# Altium schematic sheet ESP32-C3.SchDoc
size C; Date: 6/12/2025; CheckedBy: -; DrawnBy: Engr. Khaqan; Revision: -; SheetNumber: 1; SheetTotal: 1; Size: A3; VerifiedBy: -
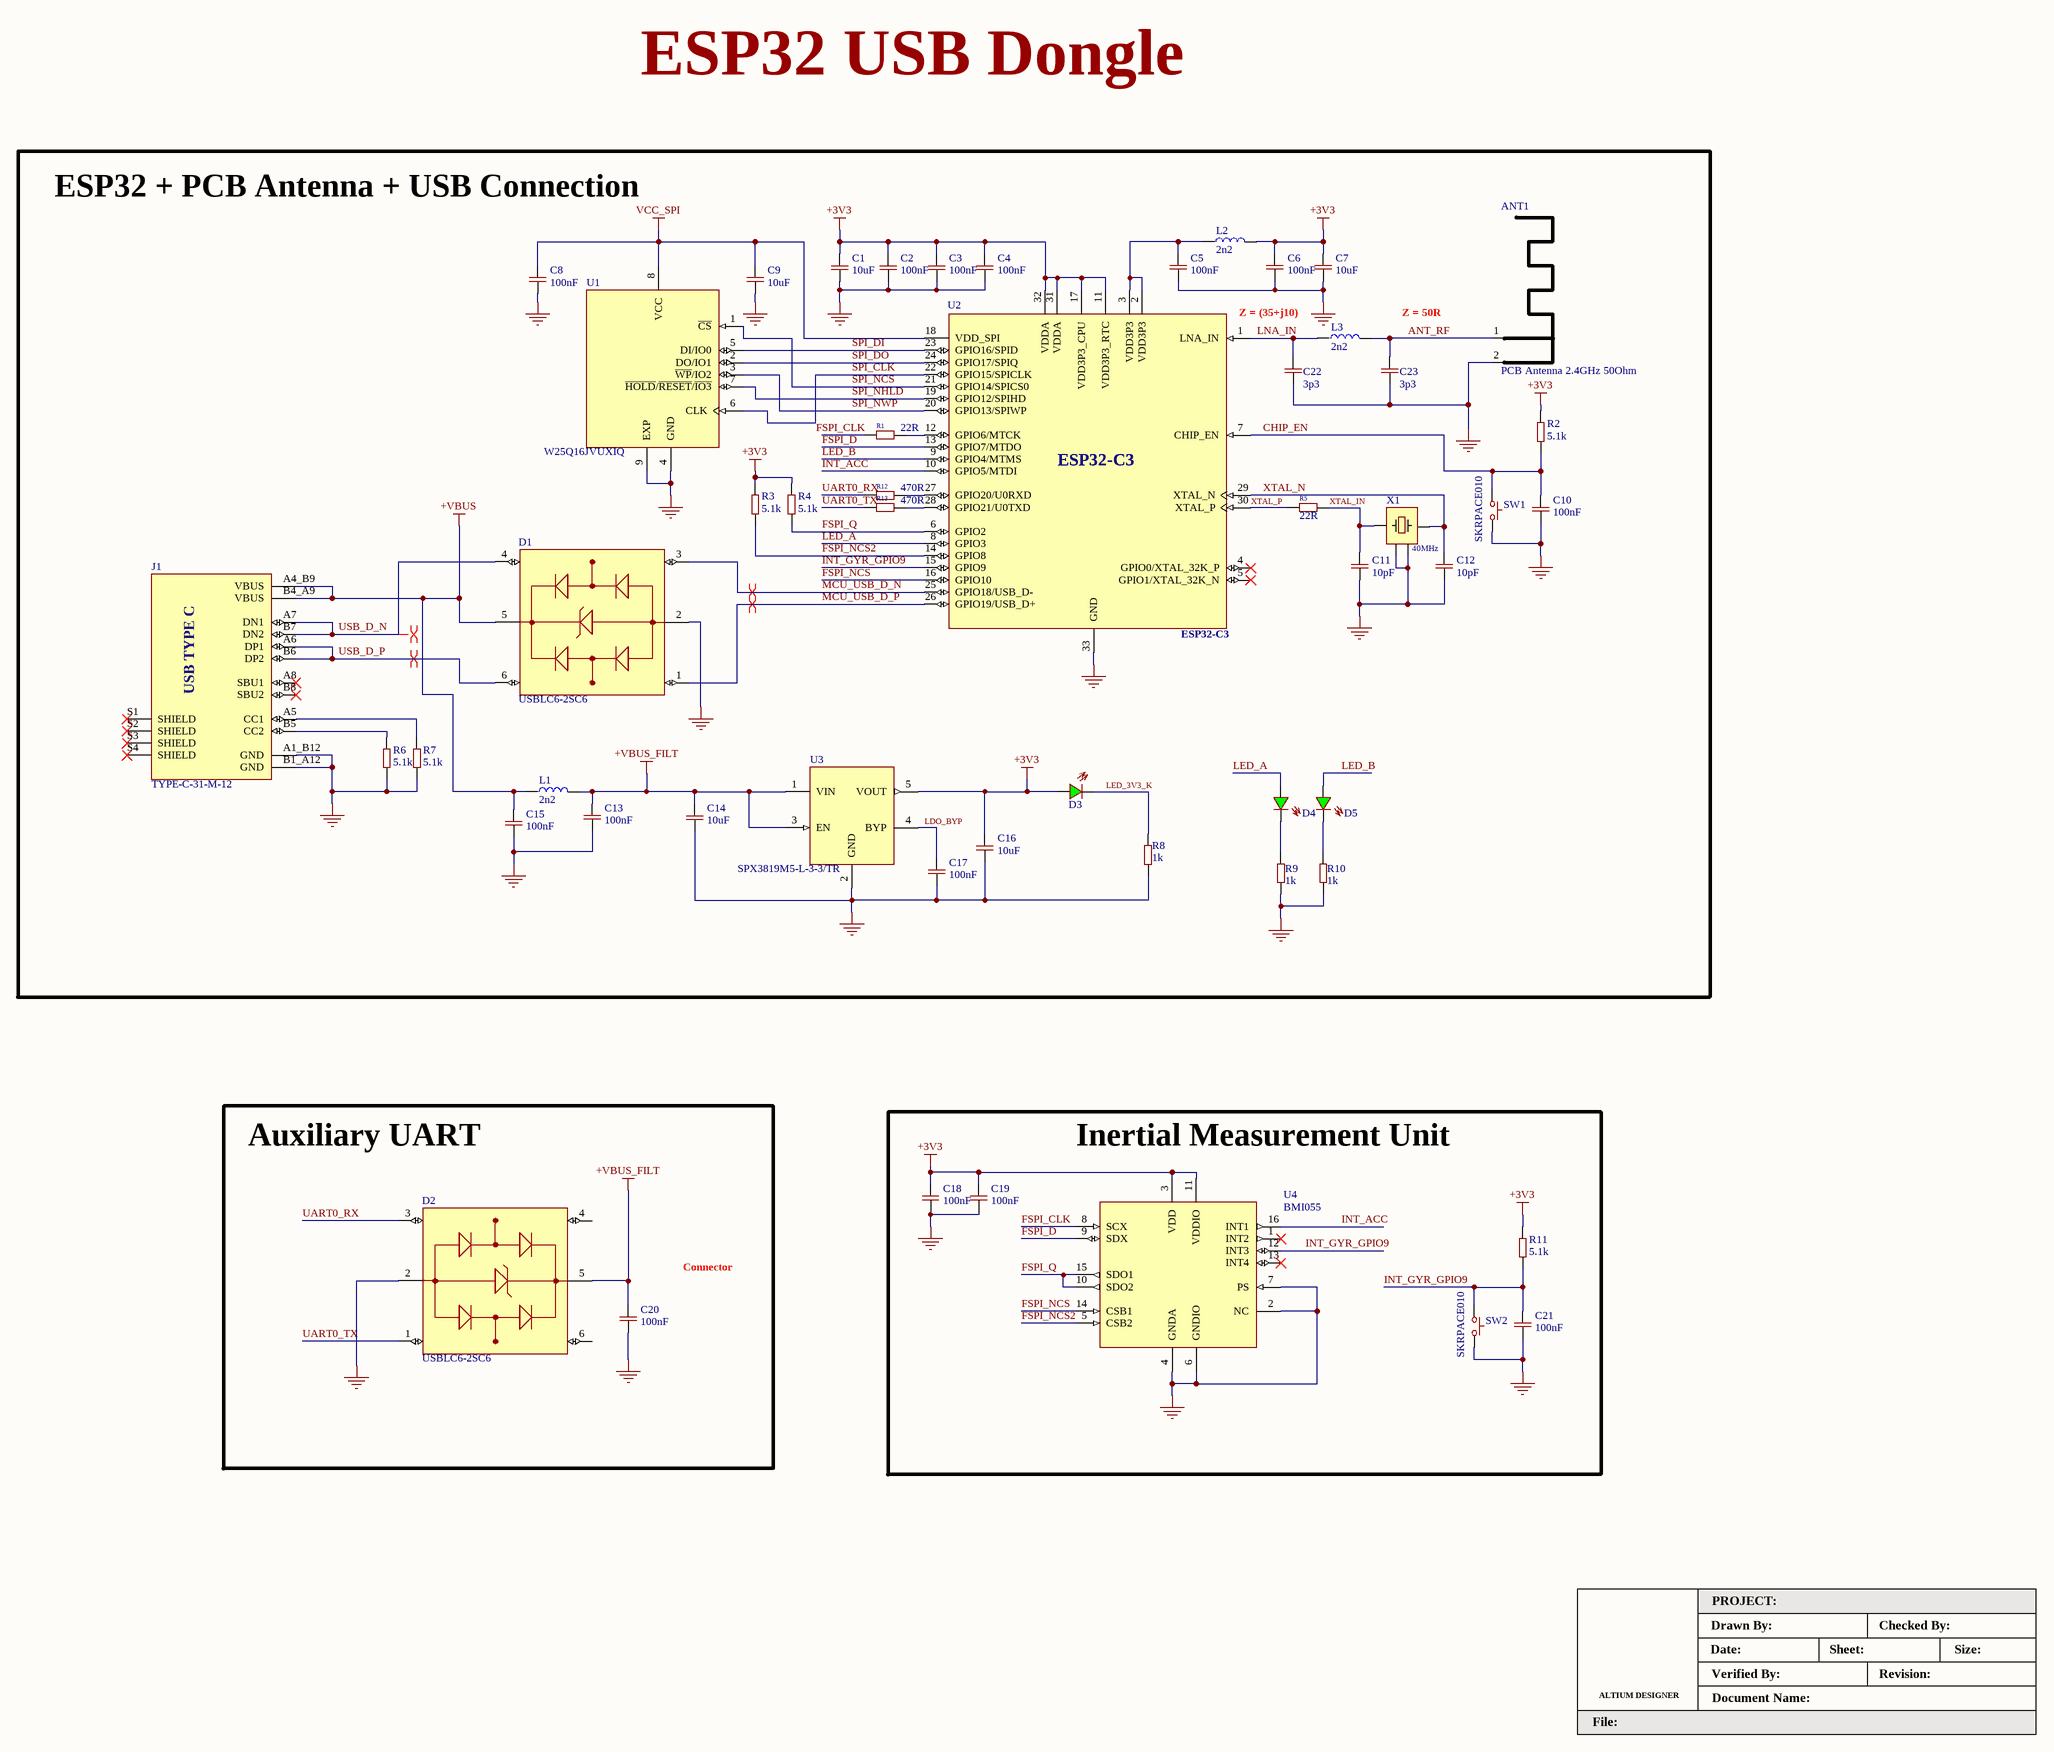
[diagram p0: ESP32-C3.SchDoc]

## Parts
ANT1  PCB Antenna 2.4GHz 50Ohm  [ANT_IFA_USB_2_4GHz_50R]
C1  10uF  [CAP_0603]
C2  100nF  [CAP_0402]
C3  100nF  [CAP_0402]
C4  100nF  [CAP_0402]
C5  100nF  [CAP_0402]
C6  100nF  [CAP_0402]
C7  10uF  [CAP_0603]
C8  100nF  [CAP_0402]
C9  10uF  [CAP_0603]
C10  100nF  [CAP_0402]
C11  10pF  [CAP_0402]
C12  10pF  [CAP_0402]
C13  100nF  [CAP_0402]
C14  10uF  [CAP_0603]
C15  100nF  [CAP_0402]
C16  10uF  [CAP_0603]
C17  100nF  [CAP_0402]
C18  100nF  [CAP_0402]
C19  100nF  [CAP_0402]
C20  100nF  [CAP_0402]
C21  100nF  [CAP_0402]
C22  3p3  [CAP_0402]
C23  3p3  [CAP_0402]
D1  USBLC6-2SC6  [USBLC6-2SC6]
D2  USBLC6-2SC6  [USBLC6-2SC6]
D3  16-213/GHC-YR1S1/3T  [LED_0402_GREEN_SMD]  (value not drawn)
D4  16-213/GHC-YR1S1/3T  [LED_0402_GREEN_SMD]  (value not drawn)
D5  16-213/GHC-YR1S1/3T  [LED_0402_GREEN_SMD]  (value not drawn)
J1  TYPE-C-31-M-12  [TYPE-C-31-M-12]
L1  2n2  [IND_SMD_0402]
L2  2n2  [IND_SMD_0402]
L3  2n2  [IND_SMD_0402]
R1  22R  [RES_0402]
R2  5.1k  [RES_0402]
R3  5.1k  [RES_0402]
R4  5.1k  [RES_0402]
R5  22R  [RES_0402]
R6  5.1k  [RES_0402]
R7  5.1k  [RES_0402]
R8  1k  [RES_0402]
R9  1k  [RES_0402]
R10  1k  [RES_0402]
R11  5.1k  [RES_0402]
R12  470R  [RES_0402]
R13  470R  [RES_0402]
SW1  SKRPACE010  [Tactile Switch]
SW2  SKRPACE010  [Tactile Switch]
U1  W25Q16JVUXIQ  [W25Q16JVUXIQ]
U2  ESP32-C3  [ESP32-C3]
U3  SPX3819M5-L-3-3/TR  [SPX3819M5-L-3-3/TR]
U4  BMI055  [BMI055]
X1  40MHz  [XTAL_40MHz_2520]

## Blocks framed on the sheet
ESP32 + PCB Antenna + USB Connection: ANT1 C1-C17 C22 C23 D1 D3-D5 J1 L1-L3 R1-R10 R12 R13 SW1 U1-U3 X1
Auxiliary UART: C20 D2
Inertial Measurement Unit: C18 C19 C21 R11 SW2 U4

## Nets
+3V3: C1.2 C2.2 C3.2 C4.2 C6.2 C7.2 C16.2 C18.2 C19.2 D3.1 L2.2 R2.2 R3.2 R4.2 R11.2 U2.11(VDD3P3_RTC) U2.17(VDD3P3_CPU) U2.31(VDDA) U2.32(VDDA) U3.5(VOUT) U4.3(VDD) U4.11(VDDIO)
+VBUS: C15.2 D1.5(VBUS) J1.A4_B9(VBUS) J1.B4_A9(VBUS) L1.1
+VBUS_FILT: C13.2 C14.2 C20.2 D2.5(VBUS) L1.2 U3.1(VIN) U3.3(EN)
GND: ANT1.2(GND) C1.1 C2.1 C3.1 C4.1 C5.1 C6.1 C7.1 C8.1 C9.1 C10.1 C11.1 C12.1 C13.1 C14.1 C15.1 C16.1 C17.1 C18.1 C19.1 C20.1 C21.1 C22.1 C23.1 D1.2(GND) D2.2(GND) J1.A1_B12(GND) J1.B1_A12(GND) R6.1 R7.1 R8.1 R9.1 R10.1 SW1.2 SW2.2 U1.4(GND) U1.9(EXP) U2.33(GND) U3.2(GND) U4.2(NC) U4.4(GNDA) U4.6(GNDIO) U4.7(PS) X1.2 X1.4
VCC_SPI: C8.2 C9.2 U1.8(VCC) U2.18(VDD_SPI)
ANT_RF: ANT1.1(RF) C23.2 L3.2
CHIP_EN: C10.2 R2.1 SW1.1 U2.7(CHIP_EN)
FSPI_CLK: U4.8(SCX)
FSPI_D: U2.13(GPIO7/MTDO) U4.9(SDX)
FSPI_NCS: U2.16(GPIO10) U4.14(CSB1)
FSPI_NCS2: R3.1 U2.14(GPIO8) U4.5(CSB2)
FSPI_Q: R4.1 U2.6(GPIO2) U4.10(SDO2) U4.15(SDO1)
INT_ACC: U2.10(GPIO5/MTDI) U4.16(INT1)
INT_GYR_GPIO9: C21.2 R11.1 SW2.1 U2.15(GPIO9) U4.12(INT3)
LDO_BYP: C17.2 U3.4(BYP)
LED_3V3_K: D3.2 R8.2
LED_A: D4.1 U2.8(GPIO3)
LED_B: D5.1 U2.9(GPIO4/MTMS)
LNA_IN: C22.2 L3.1 U2.1(LNA_IN)
MCU_USB_D_N: D1.3(I/O2_IN) U2.25(GPIO18/USB_D-)
MCU_USB_D_P: D1.1(I/O1_IN) U2.26(GPIO19/USB_D+)
SPI_CLK: U1.6(CLK) U2.22(GPIO15/SPICLK)
SPI_DI: U1.5(DI/IO0) U2.23(GPIO16/SPID)
SPI_DO: U1.2(DO/IO1) U2.24(GPIO17/SPIQ)
SPI_NCS: U1.1(~{CS}) U2.21(GPIO14/SPICS0)
SPI_NHLD: U1.7(~{HOLD}/~{RESET}/~{IO3}) U2.19(GPIO12/SPIHD)
SPI_NWP: U1.3(~{WP}/IO2) U2.20(GPIO13/SPIWP)
UART0_RX: D2.3(I/O2_IN) R12.1
UART0_TX: D2.1(I/O1_IN) R13.1
USB_D_N: D1.4(I/O2_OUT) J1.A7(DN1) J1.B7(DN2)
USB_D_P: D1.6(I/O1_OUT) J1.A6(DP1) J1.B6(DP2)
XTAL_IN: C11.2 R5.2 X1.1
XTAL_N: C12.2 U2.29(XTAL_N) X1.3
XTAL_P: R5.1 U2.30(XTAL_P)
NetC5_2: C5.2 L2.1 U2.2(VDD3P3) U2.3(VDD3P3)
NetD4_2: D4.2 R9.2
NetD5_2: D5.2 R10.2
NetJ1_A5: J1.A5(CC1) R7.2
NetJ1_B5: J1.B5(CC2) R6.2
NetR1_2: R1.2 U2.12(GPIO6/MTCK)
NetR12_2: R12.2 U2.27(GPIO20/U0RXD)
NetR13_2: R13.2 U2.28(GPIO21/U0TXD)

Not connected (* = marked no-connect by the designer): D2 4(I/O2_OUT) 6(I/O1_OUT); J1 A8(SBU1)* B8(SBU2)* S1(SHIELD)* S2(SHIELD)* S3(SHIELD)* S4(SHIELD)*; R1 1; U2 4(GPIO0/XTAL_32K_P)* 5(GPIO1/XTAL_32K_N)*; U4 1(INT2)* 13(INT4)*

## Layout directives
differential pair: MCU_USB_D_N, MCU_USB_D_P, USB_D_N, USB_D_P

## Notes on the sheet
- ESP32 USB Dongle
- (near U2) Z = (35+j10)
- Z = 50R
- Connector
- PROJECT:
- Date:
- Drawn By:
- Verified By:
- Sheet:
- Revision:
- Checked By:
- Size:
- ALTIUM DESIGNER
- File:
- Document Name:
- Labels drawn without touching a wire or pin: FSPI_CLK
- (in symbol TYPE-C-31-M-12) USB TYPE C

## Library data of the parts
ANT1 = ANT_IFA_USB_2_4GHz_50R: Inverted F 2.4GHz ISM PCB Antenna 50Ohm
C1 C7 C9 C14 C16 = CAP_0603: Ceramic Capacitor, Multilayer, Ceramic, 10V, 10% +Tol, 10% -Tol, X5R, +-15% TC, 10uF, Surface Mount, 0603 inch; Manufacturer: Samsung Electro-Mechanics; Manufacturer Part Number: CL10A106KP8NNNC; Value: 10µF; LCSC: C19702; Supplier: DigiKey; Supplier Part Number: 1276-1192-1-ND; RoHS: Compliant; Category: Ceramic Capacitors; Stock: 3199651; Pricing: 1=0.08, 10=0.027 (USD); Case/Package: 0603; Case Code (Imperial): 0603; Case Code (Metric): 1608; China RoHS: Compliant; Contact Plating: Tin; Depth: 800µm; Dielectric: X5R; Dielectric Material: Ceramic; Height: 800µm; Lead Free: Lead Free; Length: 1.6mm; Lifecycle Status: Production; Material: Ceramic; Max Operating Temperature: 85°C; Min Operating Temperature: -55°C; Mounting Technology: Surface Mount; Number of Terminals: 2; Radiation Hardening: No; REACH SVHC: Yes; Schedule B: 8532240020, 8532240020|8532240020|8532240020|8532240020|8532240020|8532240020|8532240020|8532240020|8532240020|8532240020|8532240020|8532240020|8532240020|8532240020|8532240020|8532240020|8532240020|8532240020|8532240020|8532240020|8532240020|8532240020|8532240020|85; Thickness: 889µm; Tolerance: 10%; Voltage Rating: 10V; Voltage Rating (DC): 10V; Width: 800µm; ComponentLink1URL: https://datasheet.octopart.com:443/CL10A106KP8NNNC-Samsung-Electro-Mechanics-datasheet-181960519.pdf?src-supplier=Newark; ComponentLink1Description: https://datasheet.octopart.com:443/CL10A106KP8NNNC-Samsung-Electro-Mechanics-datasheet-181960519.pdf?src-supplier=Newark; ComponentLink2URL: https://datasheet.octopart.com/CL10A106KP8NNNC-Samsung-Electro-Mechanics-datasheet-8324245.pdf; ComponentLink2Description: https://datasheet.octopart.com/CL10A106KP8NNNC-Samsung-Electro-Mechanics-datasheet-8324245.pdf; ComponentLink3URL: https://datasheet.octopart.com/CL10A106KP8NNNC-Samsung-Electro-Mechanics-datasheet-97040617.pdf; ComponentLink3Description: https://datasheet.octopart.com/CL10A106KP8NNNC-Samsung-Electro-Mechanics-datasheet-97040617.pdf; ComponentLink4URL: https://datasheet.octopart.com:443/CL10A106KP8NNNC-Samsung-Electro-Mechanics-datasheet-136031754.pdf?src-supplier=Future+Electronics; ComponentLink4Description: https://datasheet.octopart.com:443/CL10A106KP8NNNC-Samsung-Electro-Mechanics-datasheet-136031754.pdf?src-supplier=Future+Electronics; ComponentLink5URL: https://datasheet.octopart.com:443/CL10A106KP8NNNC-Samsung-Electro-Mechanics-datasheet-110226289.pdf?src-supplier=Future+Electronics; ComponentLink5Description: https://datasheet.octopart.com:443/CL10A106KP8NNNC-Samsung-Electro-Mechanics-datasheet-110226289.pdf?src-supplier=Future+Electronics; ComponentLink6URL: https://datasheet.octopart.com:443/CL10A106KP8NNNC-Samsung-Electro-Mechanics-datasheet-81461787.pdf?src-supplier=Future+Electronics; ComponentLink6Description: https://datasheet.octopart.com:443/CL10A106KP8NNNC-Samsung-Electro-Mechanics-datasheet-81461787.pdf?src-supplier=Future+Electronics; ComponentLink7URL: https://datasheet.octopart.com:443/CL10A106KP8NNNC-Samsung-datasheet-48647232.pdf?src-supplier=Future+Electronics; ComponentLink7Description: https://datasheet.octopart.com:443/CL10A106KP8NNNC-Samsung-datasheet-48647232.pdf?src-supplier=Future+Electronics; ComponentLink8URL: https://datasheet.octopart.com:443/CL10A106KP8NNNC-Samsung-datasheet-34157262.pdf?src-supplier=Future+Electronics; ComponentLink8Description: https://datasheet.octopart.com:443/CL10A106KP8NNNC-Samsung-datasheet-34157262.pdf?src-supplier=Future+Electronics; ComponentLink9URL: https://datasheet.octopart.com:443/CL10A106KP8NNNC-Samsung-datasheet-26589120.pdf?src-supplier=Future+Electronics; ComponentLink9Description: https://datasheet.octopart.com:443/CL10A106KP8NNNC-Samsung-datasheet-26589120.pdf?src-supplier=Future+Electronics; ComponentLink10URL: https://datasheet.octopart.com:443/CL10A106KP8NNNC-Samsung-Electro-Mechanics-datasheet-149156481.pdf?src-supplier=Future+Electronics; ComponentLink10Description: https://datasheet.octopart.com:443/CL10A106KP8NNNC-Samsung-Electro-Mechanics-datasheet-149156481.pdf?src-supplier=Future+Electronics; ComponentLink11URL: https://datasheet.octopart.com:443/CL10A106KP8NNNC-Samsung-Electro-Mechanics-datasheet-11968064.pdf?src-supplier=Arrow+Electronics; ComponentLink11Description: https://datasheet.octopart.com:443/CL10A106KP8NNNC-Samsung-Electro-Mechanics-datasheet-11968064.pdf?src-supplier=Arrow+Electronics; ComponentLink12URL: https://datasheet.octopart.com:443/CL10A106KP8NNNC-Samsung-datasheet-8326407.pdf?src-supplier=TME; ComponentLink12Description: https://datasheet.octopart.com:443/CL10A106KP8NNNC-Samsung-datasheet-8326407.pdf?src-supplier=TME
C2-C6 C8 C10 C13 C15 C17-C21 = CAP_0402: Ceramic Capacitor, Multilayer, Ceramic, 16V, 10% +Tol, 10% -Tol, X7R, +-15% TC, 100nF, Surface Mount, 0402 inch; Manufacturer: Samsung Electro-Mechanics; Manufacturer Part Number: CL05B104KO5NNNC; Supplier: DigiKey; Supplier Part Number: 1276-1001-1-ND; RoHS: Compliant; Category: Ceramic Capacitors; Stock: 9075; Pricing: 1=0.08, 10=0.006, 50=0.006, 100=0.0056, 500=0.0048, 1000=0.0032 (USD); Value: 100nF; Case/Package: 0402; Case Code (Imperial): 0402; Case Code (Metric): 1005; China RoHS: Compliant; Contact Plating: Tin; Depth: 500µm; Dielectric: X7R; Dielectric Material: Ceramic; Height: 500µm; Lead Free: Lead Free; Length: 1mm; Lifecycle Status: Production; Material: Ceramic; Max Operating Temperature: 125°C; Min Operating Temperature: -55°C; Mounting Technology: Surface Mount; Number of Terminals: 2; Radiation Hardening: No; REACH SVHC: Yes; Schedule B: 8532240020, 8532240020|8532240020|8532240020|8532240020|8532240020|8532240020|8532240020|8532240020|8532240020|8532240020|8532240020|8532240020|8532240020|8532240020|8532240020|8532240020|8532240020|8532240020|8532240020|8532240020|8532240020|8532240020|8532240020|85; Thickness: 558.8µm; Tolerance: 10%; Voltage: 16V; Voltage Rating: 16V; Voltage Rating (DC): 16V; Width: 500µm; ComponentLink1URL: https://datasheet.octopart.com:443/CL05B104KO5NNNC-Samsung-Electro-Mechanics-datasheet-181960518.pdf?src-supplier=IHS; ComponentLink1Description: https://datasheet.octopart.com:443/CL05B104KO5NNNC-Samsung-Electro-Mechanics-datasheet-181960518.pdf?src-supplier=IHS; ComponentLink2URL: https://datasheet.octopart.com:443/CL05B104KO5NNNC-Samsung-Electro-Mechanics-datasheet-81461623.pdf?src-supplier=Upverter; ComponentLink2Description: https://datasheet.octopart.com:443/CL05B104KO5NNNC-Samsung-Electro-Mechanics-datasheet-81461623.pdf?src-supplier=Upverter; ComponentLink3URL: https://datasheet.octopart.com/CL05B104KO5NNNC-Samsung-Electro-Mechanics-datasheet-8324245.pdf; ComponentLink3Description: https://datasheet.octopart.com/CL05B104KO5NNNC-Samsung-Electro-Mechanics-datasheet-8324245.pdf; ComponentLink4URL: https://datasheet.octopart.com/CL05B104KO5NNNC-Samsung-Electro-Mechanics-datasheet-97040617.pdf; ComponentLink4Description: https://datasheet.octopart.com/CL05B104KO5NNNC-Samsung-Electro-Mechanics-datasheet-97040617.pdf; ComponentLink5URL: https://datasheet.octopart.com:443/CL05B104KO5NNNC-Samsung-Electro-Mechanics-datasheet-141346863.pdf?src-supplier=Samsung+SCT; ComponentLink5Description: https://datasheet.octopart.com:443/CL05B104KO5NNNC-Samsung-Electro-Mechanics-datasheet-141346863.pdf?src-supplier=Samsung+SCT; ComponentLink6URL: https://datasheet.octopart.com:443/CL05B104KO5NNNC-Samsung-datasheet-151956582.pdf?src-supplier=SOS+electronic; ComponentLink6Description: https://datasheet.octopart.com:443/CL05B104KO5NNNC-Samsung-datasheet-151956582.pdf?src-supplier=SOS+electronic; ComponentLink7URL: https://datasheet.octopart.com:443/CL05B104KO5NNNC-Samsung-datasheet-42485123.pdf?src-supplier=Future+Electronics; ComponentLink7Description: https://datasheet.octopart.com:443/CL05B104KO5NNNC-Samsung-datasheet-42485123.pdf?src-supplier=Future+Electronics; ComponentLink8URL: https://datasheet.octopart.com:443/CL05B104KO5NNNC-Samsung-datasheet-34153835.pdf?src-supplier=Future+Electronics; ComponentLink8Description: https://datasheet.octopart.com:443/CL05B104KO5NNNC-Samsung-datasheet-34153835.pdf?src-supplier=Future+Electronics; ComponentLink9URL: https://datasheet.octopart.com:443/CL05B104KO5NNNC-Samsung-datasheet-26589024.pdf?src-supplier=Future+Electronics; ComponentLink9Description: https://datasheet.octopart.com:443/CL05B104KO5NNNC-Samsung-datasheet-26589024.pdf?src-supplier=Future+Electronics; ComponentLink10URL: https://datasheet.octopart.com:443/CL05B104KO5NNNC-Samsung-Electro-Mechanics-datasheet-149136714.pdf?src-supplier=Future+Electronics; ComponentLink10Description: https://datasheet.octopart.com:443/CL05B104KO5NNNC-Samsung-Electro-Mechanics-datasheet-149136714.pdf?src-supplier=Future+Electronics; ComponentLink11URL: https://datasheet.octopart.com:443/CL05B104KO5NNNC-Samsung-datasheet-59220082.pdf?src-supplier=TME; ComponentLink11Description: https://datasheet.octopart.com:443/CL05B104KO5NNNC-Samsung-datasheet-59220082.pdf?src-supplier=TME; LCSC: C1525
C11 C12 = CAP_0402: Ceramic Capacitor, Multilayer, Ceramic, 50V, 5% +Tol, 5% -Tol, C0G, 0+-30ppm/Celcius TC, 10pF, Surface Mount, 0402 inch; Manufacturer: Samsung Electro-Mechanics; Manufacturer Part Number: CL05C100JB5NNNC; Temperature Coefficient: 30ppm/°C; Supplier: DigiKey; Supplier Part Number: 1276-1139-1-ND; RoHS: Compliant; Category: Ceramic Capacitors; Stock: 68764; Pricing: 1=0.08, 10=0.006, 50=0.0048 (USD); Value: 10pF; Case/Package: 0402; Case Code (Imperial): 0402; Case Code (Metric): 1005; China RoHS: Compliant; Contact Plating: Tin; Depth: 500µm; Dielectric: C0G; Dielectric Material: Ceramic; Height: 550µm; Length: 1mm; Lifecycle Status: Production; Material: Ceramic; Max Operating Temperature: 125°C; Min Operating Temperature: -55°C; Mounting Technology: Surface Mount; Number of Terminals: 2; Radiation Hardening: No; REACH SVHC: Yes; Schedule B: 8532240020, 8532240020|8532240020, 8532240020|8532240020|8532240020, 8532240020|8532240020|8532240020|8532240020; Thickness: 558.8µm; Tolerance: 5%; Voltage Rating: 50V; Voltage Rating (DC): 50V; Width: 500µm; ComponentLink1URL: https://datasheet.octopart.com:443/CL05C100JB5NNNC-Samsung-Electro-Mechanics-datasheet-136482242.pdf?src-supplier=IHS; ComponentLink1Description: https://datasheet.octopart.com:443/CL05C100JB5NNNC-Samsung-Electro-Mechanics-datasheet-136482242.pdf?src-supplier=IHS; ComponentLink2URL: https://datasheet.octopart.com:443/CL05C100JB5NNNC-Samsung-Electro-Mechanics-datasheet-11758155.pdf?src-supplier=Future+Electronics; ComponentLink2Description: https://datasheet.octopart.com:443/CL05C100JB5NNNC-Samsung-Electro-Mechanics-datasheet-11758155.pdf?src-supplier=Future+Electronics; ComponentLink3URL: https://datasheet.octopart.com:443/CL05C100JB5NNNC-Samsung-Electro-Mechanics-datasheet-110226242.pdf?src-supplier=Future+Electronics; ComponentLink3Description: https://datasheet.octopart.com:443/CL05C100JB5NNNC-Samsung-Electro-Mechanics-datasheet-110226242.pdf?src-supplier=Future+Electronics; ComponentLink4URL: https://datasheet.octopart.com:443/CL05C100JB5NNNC-Samsung-Electro-Mechanics-datasheet-81461703.pdf?src-supplier=Future+Electronics; ComponentLink4Description: https://datasheet.octopart.com:443/CL05C100JB5NNNC-Samsung-Electro-Mechanics-datasheet-81461703.pdf?src-supplier=Future+Electronics; ComponentLink5URL: https://datasheet.octopart.com:443/CL05C100JB5NNNC-Samsung-datasheet-12525757.pdf?src-supplier=Future+Electronics; ComponentLink5Description: https://datasheet.octopart.com:443/CL05C100JB5NNNC-Samsung-datasheet-12525757.pdf?src-supplier=Future+Electronics; ComponentLink6URL: https://datasheet.octopart.com:443/CL05C100JB5NNNC-Samsung-Electro-Mechanics-datasheet-149136756.pdf?src-supplier=Future+Electronics; ComponentLink6Description: https://datasheet.octopart.com:443/CL05C100JB5NNNC-Samsung-Electro-Mechanics-datasheet-149136756.pdf?src-supplier=Future+Electronics; ComponentLink7URL: https://datasheet.octopart.com:443/CL05C100JB5NNNC-Samsung-datasheet-37081328.pdf?src-supplier=Future+Electronics; ComponentLink7Description: https://datasheet.octopart.com:443/CL05C100JB5NNNC-Samsung-datasheet-37081328.pdf?src-supplier=Future+Electronics; ComponentLink8URL: https://datasheet.octopart.com/CL05C100JB5NNNC-Samsung-Electro-Mechanics-datasheet-97040617.pdf; ComponentLink8Description: https://datasheet.octopart.com/CL05C100JB5NNNC-Samsung-Electro-Mechanics-datasheet-97040617.pdf; ComponentLink9URL: https://datasheet.octopart.com/CL05C100JB5NNNC-Samsung-Electro-Mechanics-datasheet-8324245.pdf; ComponentLink9Description: https://datasheet.octopart.com/CL05C100JB5NNNC-Samsung-Electro-Mechanics-datasheet-8324245.pdf; ComponentLink10URL: https://datasheet.octopart.com:443/CL05C100JB5NNNC-Samsung-datasheet-59220082.pdf?src-supplier=TME; ComponentLink10Description: https://datasheet.octopart.com:443/CL05C100JB5NNNC-Samsung-datasheet-59220082.pdf?src-supplier=TME; LCSC: C32949
C22 C23 = CAP_0402: 3.3pF 50V Ceramic Capacitor C0G 0402; Manufacturer: FH; Manufacturer Part Number: 0402CG3R3C500NT; LCSC: C1565
D1 D2 = USBLC6-2SC6: STMicroelectronics USBLC6-2SC6 TVS diode surge protection on full tape reel; Breakdown Voltage: 6V; Value: 2.5pF; Clamping Voltage: 17V; Data Rate: 480Mbps; Direction: Unidirectional; Element Configuration: Dual; ESD Protection: Yes; Forward Voltage: 1.1V; Leakage Current: 150nA; Max Junction Temperature (Tj): 125°C; Max Repetitive Reverse Voltage (Vrrm): 5.25V; Number of Bidirectional Channels: 2; Number of Elements: 1; Peak Pulse Current: 5A; Reverse Standoff Voltage: 5V; Test Current: 1mA; Supplier: DigiKey; Supplier Part Number: 497-5235-1-ND; Manufacturer: STMicroelectronics; Manufacturer Part Number: USBLC6-2SC6; RoHS: Compliant; Category: TVS Diodes; Stock: 156375; Pricing: 1=0.36, 10=0.243, 100=0.163, 500=0.127, 1000=0.114 (USD); Case/Package: SOT-23; China RoHS: Compliant; Contact Plating: Tin; Depth: 1.75mm; Height: 1.45mm; Lead Free: Lead Free; Length: 3.05mm; Lifecycle Status: Production; Max Breakdown Voltage: 6V; Max Operating Temperature: 125°C; Max Reverse Leakage Current: 150nA; Min Breakdown Voltage: 6V; Min Operating Temperature: -40°C; Mounting Technology: Surface Mount; Number of Channels: 2; Pins: 6; Number of Terminals: 6; Operating Supply Voltage: 1.1V; Peak Reverse Current: 150nA; Polarity: Unidirectional; Power Line Protection: Yes; Radiation Hardening: No; REACH SVHC: Yes; Reverse Breakdown Voltage: 6V; Schedule B: 8536300000, 8536300000|8536300000|8536300000|8536300000|8536300000|8536300000|8536300000|8536300000|8536300000|8536300000|8536300000|8536300000|8536300000|8536300000|8536300000|8536300000|8536300000|8536300000|8536300000|8536300000|8536300000|8536300000|8536300000|85; Termination: SMD/SMT; Width: 1.75mm; Working Voltage: 5V; ComponentLink1URL: https://datasheet.octopart.com:443/USBLC6-2SC6-STMicroelectronics-datasheet-10412581.pdf?src-supplier=Newark; ComponentLink1Description: https://datasheet.octopart.com:443/USBLC6-2SC6-STMicroelectronics-datasheet-10412581.pdf?src-supplier=Newark; ComponentLink2URL: https://datasheet.octopart.com:443/USBLC6-2SC6-STMicroelectronics-datasheet-181961833.pdf?src-supplier=Newark; ComponentLink2Description: https://datasheet.octopart.com:443/USBLC6-2SC6-STMicroelectronics-datasheet-181961833.pdf?src-supplier=Newark; ComponentLink3URL: https://datasheet.octopart.com:443/USBLC6-2SC6-STMicroelectronics-datasheet-525477.pdf?src-supplier=Factory+Futures; ComponentLink3Description: https://datasheet.octopart.com:443/USBLC6-2SC6-STMicroelectronics-datasheet-525477.pdf?src-supplier=Factory+Futures; ComponentLink4URL: https://datasheet.octopart.com:443/USBLC6-2SC6-STMicroelectronics-datasheet-82998616.pdf?src-supplier=Farnell; ComponentLink4Description: https://datasheet.octopart.com:443/USBLC6-2SC6-STMicroelectronics-datasheet-82998616.pdf?src-supplier=Farnell; ComponentLink5URL: https://datasheet.octopart.com:443/USBLC6-2SC6-STMicroelectronics-datasheet-46285.pdf?src-supplier=Farnell; ComponentLink5Description: https://datasheet.octopart.com:443/USBLC6-2SC6-STMicroelectronics-datasheet-46285.pdf?src-supplier=Farnell; ComponentLink6URL: https://datasheet.octopart.com:443/USBLC6-2SC6-STMicroelectronics-datasheet-14050643.pdf?src-supplier=iiiC; ComponentLink6Description: https://datasheet.octopart.com:443/USBLC6-2SC6-STMicroelectronics-datasheet-14050643.pdf?src-supplier=iiiC; ComponentLink7URL: https://datasheet.octopart.com:443/USBLC6-2SC6-STMicroelectronics-datasheet-10521292.pdf?src-supplier=Jameco; ComponentLink7Description: https://datasheet.octopart.com:443/USBLC6-2SC6-STMicroelectronics-datasheet-10521292.pdf?src-supplier=Jameco; LCSC: C7519
D3-D5 = LED_0402_GREEN_SMD: Emerald Green 518nm LED Indication - Discrete 0402; Manufacturer: EVERLIGHT; Manufacturer Part Number: 16-213/GHC-YR1S1/3T; LCSC: C74338
J1 = TYPE-C-31-M-12: USB-C (USB TYPE-C) Receptacle Connector 16 Position Surface Mount; Manufacturer: Korean Hroparts Elec; Manufacturer Part Number: TYPE-C-31-M-12; LCSC: C165948
L1-L3 = IND_SMD_0402: Manufacturer: muRata; Manufacturer Part Number: LQW15AN2N2G80D; LCSC: C412264
R1 R5 = RES_0402: 22Ω 62.5mW 50V ±100ppm/℃ Thick Film Resistor ±1% 0402 Chip Resistor - Surface Mount RoHS; Manufacturer: UNI-ROYAL; Manufacturer Part Number: 0402WGF220JTCE; LCSC: C25092
R2-R4 R11 = RES_0402: 5.1kΩ 62.5mW 50V ±100ppm/℃ Thick Film Resistor ±1% 0402 Chip Resistor - Surface Mount RoHS; Manufacturer: UNI-ROYAL; Manufacturer Part Number: 0402WGF5101TCE; LCSC: C25905
R6 R7 = RES_0402: 5.1 kOhms ±5% 0.063W, 1/16W Chip Resistor 0402 (1005 Metric) Moisture Resistant Thick Film; Manufacturer: YAGEO; Manufacturer Part Number: RC0402JR-075K1L; LCSC: C105873
R8-R10 = RES_0402: 1kΩ ±1% 62.5mW 0402 Thick Film Resistor; Manufacturer: UNI-ROYAL; Manufacturer Part Number: 0402WGF1001TCE; LCSC: C11702
R12 R13 = RES_0402: 470Ω ±1% 62.5mW 0402 Thick Film Resistor; Manufacturer: UNI-ROYAL; Manufacturer Part Number: 0402WGF4700TCE; LCSC: C25117
SW1 SW2 = Tactile Switch: Switch Tactile N.O. SPST Button J-Bend 0.05A 16VDC 2.55N SMD T/R; Manufacturer: ALPS; Actuator Length: 700µm; Contact Current Rating: 50mA; Contact Resistance: 500mΩ; Electrical Life: 50kcycles; Insulation Resistance: 100MΩ; Max Voltage Rating (DC): 16V; Number of Positions: 1; Supplier: DigiKey; Supplier Part Number: 4809-SKRPACE010DKR-ND; Manufacturer Part Number: SKRPACE010; RoHS: Compliant; Category: Tactile Switches; Pricing: 1=0.21, 10=0.179, 25=0.1684, 100=0.1511, 250=0.14016, 500=0.13228, 1000=0.12484 (USD); Case/Package: SMD/SMT; Color: Natural; Contact Plating: Silver; Current Rating: 50mA; Depth: 3.2mm; Height: 1.6mm; Lead Free: Lead Free; Length: 4.2mm; Life (Cycles): 50kcycles; Lifecycle Status: Production; Max Current Rating: 50mA; Max Operating Temperature: 85°C; Min Operating Temperature: -30°C; Mounting Technology: Surface Mount; Operating Force: 2.55N; Orientation: Straight; Packaging: Tape and Reel; Radiation Hardening: No; REACH SVHC: Yes; Schedule B: 8536509065; Termination: J-Bend; Throw Configuration: SPST; Voltage Rating (DC): 16V; ComponentLink1URL: https://datasheet.octopart.com:443/SKRPACE010-ALPS-datasheet-182234810.pdf?src-supplier=IHS; ComponentLink1Description: https://datasheet.octopart.com:443/SKRPACE010-ALPS-datasheet-182234810.pdf?src-supplier=IHS; ComponentLink2URL: https://datasheet.octopart.com:443/SKRPACE010-ALPS-datasheet-182235267.pdf?src-supplier=IHS; ComponentLink2Description: https://datasheet.octopart.com:443/SKRPACE010-ALPS-datasheet-182235267.pdf?src-supplier=IHS; ComponentLink3URL: https://datasheet.octopart.com:443/SKRPACE010-ALPS-datasheet-41327040.pdf?src-supplier=Master+Electronics; ComponentLink3Description: https://datasheet.octopart.com:443/SKRPACE010-ALPS-datasheet-41327040.pdf?src-supplier=Master+Electronics; ComponentLink4URL: https://datasheet.octopart.com:443/SKRPACE010-ALPS-datasheet-138899522.pdf?src-supplier=TME; ComponentLink4Description: https://datasheet.octopart.com:443/SKRPACE010-ALPS-datasheet-138899522.pdf?src-supplier=TME; ComponentLink5URL: https://datasheet.octopart.com:443/SKRPACE010-ALPS-datasheet-142045378.pdf?src-supplier=Arrow.cn; ComponentLink5Description: https://datasheet.octopart.com:443/SKRPACE010-ALPS-datasheet-142045378.pdf?src-supplier=Arrow.cn; ComponentLink6URL: https://datasheet.octopart.com:443/SKRPACE010-ALPS-datasheet-37145204.pdf?src-supplier=Electro+Sonic; ComponentLink6Description: https://datasheet.octopart.com:443/SKRPACE010-ALPS-datasheet-37145204.pdf?src-supplier=Electro+Sonic; LCSC: C139797
U1 = W25Q16JVUXIQ: NOR Flash Serial (SPI, Dual SPI, Quad SPI) 3V/3.3V 16M-bit 2M x 8 6ns 8-Pin USON EP T/R; Manufacturer: Winbond; Manufacturer Part Number: W25Q16JVUXIQ TR; Supplier: DigiKey; Supplier Part Number: 256-W25Q16JVUXIQTR-ND; Category: Memory; Stock: 16000; Pricing: 4000=0.49661, 8000=0.48422, 12000=0.47705, 20000=0.46812 (USD); Schedule B: 8542320070, 8542320070|8542320070|8542320070|8542320070|8542320070; ComponentLink1URL: https://datasheet.octopart.com:443/W25Q16JVUXIQ-TR-Winbond-datasheet-165882617.pdf?src-supplier=ODG+(Origin+Data+Global); ComponentLink1Description: https://datasheet.octopart.com:443/W25Q16JVUXIQ-TR-Winbond-datasheet-165882617.pdf?src-supplier=ODG+(Origin+Data+Global); LCSC: C2843335
U2 = ESP32-C3: 400KB 22 3V~3.6V RISC-V 160MHz QFN-32-EP(5x5) Microcontroller Units (MCUs/MPUs/SOCs) ROHS; Manufacturer: Espressif Systems; Max Supply Voltage: 3.6V; Min Supply Voltage: 3V; Operating Supply Voltage: 3.3V; Supplier: DigiKey; Supplier Part Number: 1904-ESP32-C3CT-ND; Manufacturer Part Number: ESP32-C3; Category: System on Chip (SoC); Stock: 2432; Pricing: 1=1 (USD); Height - Seated (Max): 900µm; Length: 5mm; Max Operating Temperature: 105°C; Min Operating Temperature: -40°C; Number of Terminals: 32; Terminal Pitch: 500µm; Width: 5mm; ComponentLink1URL: https://datasheet.octopart.com:443/ESP32-C3-Espressif-Systems-datasheet-156944166.pdf?src-supplier=IHS; ComponentLink1Description: https://datasheet.octopart.com:443/ESP32-C3-Espressif-Systems-datasheet-156944166.pdf?src-supplier=IHS; ComponentLink2URL: https://datasheet.octopart.com:443/ESP32-C3-Espressif-Systems-datasheet-188867343.pdf?src-supplier=TME; ComponentLink2Description: https://datasheet.octopart.com:443/ESP32-C3-Espressif-Systems-datasheet-188867343.pdf?src-supplier=TME; ComponentLink3URL: https://datasheet.octopart.com:443/ESP32-C3-Espressif-Systems-datasheet-165560559.pdf?src-supplier=TME; ComponentLink3Description: https://datasheet.octopart.com:443/ESP32-C3-Espressif-Systems-datasheet-165560559.pdf?src-supplier=TME; LCSC: C2838500
U3 = SPX3819M5-L-3-3/TR: SPX3819 Series 3.3 V 500 mA Fixed Output SMT LDO Regulator - SOT-23-5; Manufacturer: MaxLinear; Accuracy: 1%; Dropout Voltage: 340mV; Max Supply Voltage: 16V; Max Junction Temperature (Tj): 125°C; Max Output current: 500mA; Min Input Voltage: 2.5V; Min Output Voltage: 3.3V; Number of Channels: 1; Polarity: Positive; Quiescent Current: 3µA; Supplier: DigiKey; Supplier Part Number: 1016-1873-6-ND; Manufacturer Part Number: SPX3819M5-L-3-3/TR; RoHS: Compliant; Category: LDO Voltage Regulators; Stock: 67889; Pricing: 1=0.44, 10=0.306, 25=0.2724, 100=0.2361, 250=0.21876, 500=0.2083, 1000=0.19968 (USD); Case/Package: SOT-23-5; Height: 1.45mm; Height - Seated (Max): 1.45mm; Lead Free: Lead Free; Length: 2.9mm; Lifecycle Status: Production; Max Operating Temperature: 125°C; Min Operating Temperature: -40°C; Min Supply Voltage: 2.5V; Mounting Technology: Surface Mount; Number of Circuits: 1; Number of Outputs: 1; Pins: 5; Number of Regulators: 1; Number of Terminals: 5; Output Current: 500mA; Output Type: Fixed; Output Voltage: 3.3V; Output Voltage Accuracy: 1%; Packaging: Tape and Reel; Radiation Hardening: No; REACH SVHC: Yes; Schedule B: 8542310000, 8542310000|8542310000|8542310000|8542310000|8542310000; Terminal Pitch: 950µm; Voltage Tolerance: 1%; Width: 1.6mm; ComponentLink1URL: https://datasheet.octopart.com:443/SPX3819M5-L-3-3-TR-MaxLinear-datasheet-164567055.pdf?src-supplier=ODG+(Origin+Data+Global); ComponentLink1Description: https://datasheet.octopart.com:443/SPX3819M5-L-3-3-TR-MaxLinear-datasheet-164567055.pdf?src-supplier=ODG+(Origin+Data+Global); ComponentLink2URL: https://datasheet.octopart.com:443/SPX3819M5-L-3-3-TR-MaxLinear-datasheet-68096079.pdf?src-supplier=IHS; ComponentLink2Description: https://datasheet.octopart.com:443/SPX3819M5-L-3-3-TR-MaxLinear-datasheet-68096079.pdf?src-supplier=IHS; ComponentLink3URL: https://datasheet.octopart.com:443/SPX3819M5-L-3-3-TR-MaxLinear-datasheet-136412968.pdf?src-supplier=LKR; ComponentLink3Description: https://datasheet.octopart.com:443/SPX3819M5-L-3-3-TR-MaxLinear-datasheet-136412968.pdf?src-supplier=LKR; ComponentLink4URL: https://datasheet.octopart.com:443/SPX3819M5-L-3-3-TR-Exar-datasheet-27092020.pdf?src-supplier=RS+(Formerly+Allied+Electronics); ComponentLink4Description: https://datasheet.octopart.com:443/SPX3819M5-L-3-3-TR-Exar-datasheet-27092020.pdf?src-supplier=RS+(Formerly+Allied+Electronics); ComponentLink5URL: https://datasheet.octopart.com:443/SPX3819M5-L-3-3/TR-Exar-datasheet-12510291.pdf?src-supplier=Future+Electronics; ComponentLink5Description: https://datasheet.octopart.com:443/SPX3819M5-L-3-3/TR-Exar-datasheet-12510291.pdf?src-supplier=Future+Electronics; ComponentLink6URL: https://datasheet.octopart.com:443/SPX3819M5-L-3-3/TR-Exar-datasheet-530831.pdf?src-supplier=Future+Electronics; ComponentLink6Description: https://datasheet.octopart.com:443/SPX3819M5-L-3-3/TR-Exar-datasheet-530831.pdf?src-supplier=Future+Electronics; ComponentLink7URL: https://datasheet.octopart.com:443/SPX3819M5-L-3-3-TR-Exar-datasheet-13046336.pdf?src-supplier=Future+Electronics; ComponentLink7Description: https://datasheet.octopart.com:443/SPX3819M5-L-3-3-TR-Exar-datasheet-13046336.pdf?src-supplier=Future+Electronics; ComponentLink8URL: https://datasheet.octopart.com:443/SPX3819M5-L-3-3/TR-Exar-datasheet-14171829.pdf?src-supplier=iiiC; ComponentLink8Description: https://datasheet.octopart.com:443/SPX3819M5-L-3-3/TR-Exar-datasheet-14171829.pdf?src-supplier=iiiC; LCSC: C9055
U4 = BMI055: LGA-16(3x4.5) Accelerometers RoHS; Manufacturer: Bosch; Manufacturer Part Number: BMI055; LCSC: C189620
X1 = XTAL_40MHz_2520: Crystal 40MHz ±10ppm (Tol) ±20ppm (Stability) 9pF FUND 40Ohm 4-Pin Ultra Mini-CSMD T/R; Manufacturer: Epson; Manufacturer Part Number: FA-20H 40.0000MF20X-AC3; ESR (Equivalent Series Resistance): 40Ω; Frequency Tolerance: 0.001%; Supplier: DigiKey; Supplier Part Number: FA-20H40.0000MF20X-AC3-ND; RoHS: Compliant; Category: Crystals; Pricing: 250=0.98172 (USD); Case/Package: SMD/SMT; China RoHS: Compliant; Contact Plating: Gold; Frequency: 40MHz; Frequency Stability: 20ppm; Height: 558.8µm; Length: 2.4892mm; Load Capacitance: 9pF; Max Operating Temperature: 85°C; Min Operating Temperature: -40°C; Mounting Technology: Surface Mount; Packaging: Bulk; REACH SVHC: Yes; ESR: 40Ω; Width: 2.0066mm; ComponentLink1URL: https://datasheet.octopart.com:443/FA-20H-40.0000MF20X-AC3-Epson-datasheet-62043847.pdf?src-supplier=IHS; ComponentLink1Description: https://datasheet.octopart.com:443/FA-20H-40.0000MF20X-AC3-Epson-datasheet-62043847.pdf?src-supplier=IHS; ComponentLink2URL: https://datasheet.octopart.com:443/FA-20H40.0000MF20X-AC3-Epson-datasheet-189100293.pdf?src-supplier=Electro+Sonic; ComponentLink2Description: https://datasheet.octopart.com:443/FA-20H40.0000MF20X-AC3-Epson-datasheet-189100293.pdf?src-supplier=Electro+Sonic; ComponentLink3URL: http://sigma.octopart.com:80/149134829/reach_statement/Epson-FA-20H-40.0000MF20X-AC3.pdf?src-supplier=Compliance+Statements; ComponentLink3Description: http://sigma.octopart.com:80/149134829/reach_statement/Epson-FA-20H-40.0000MF20X-AC3.pdf?src-supplier=Compliance+Statements; ComponentLink4URL: http://sigma.octopart.com:80/149134830/rohs_statement/Epson-FA-20H-40.0000MF20X-AC3.pdf?src-supplier=Compliance+Statements; ComponentLink4Description: http://sigma.octopart.com:80/149134830/rohs_statement/Epson-FA-20H-40.0000MF20X-AC3.pdf?src-supplier=Compliance+Statements; LCSC: C255973